# Altium schematic sheet drive.SchDoc
size 400 x 289 mm
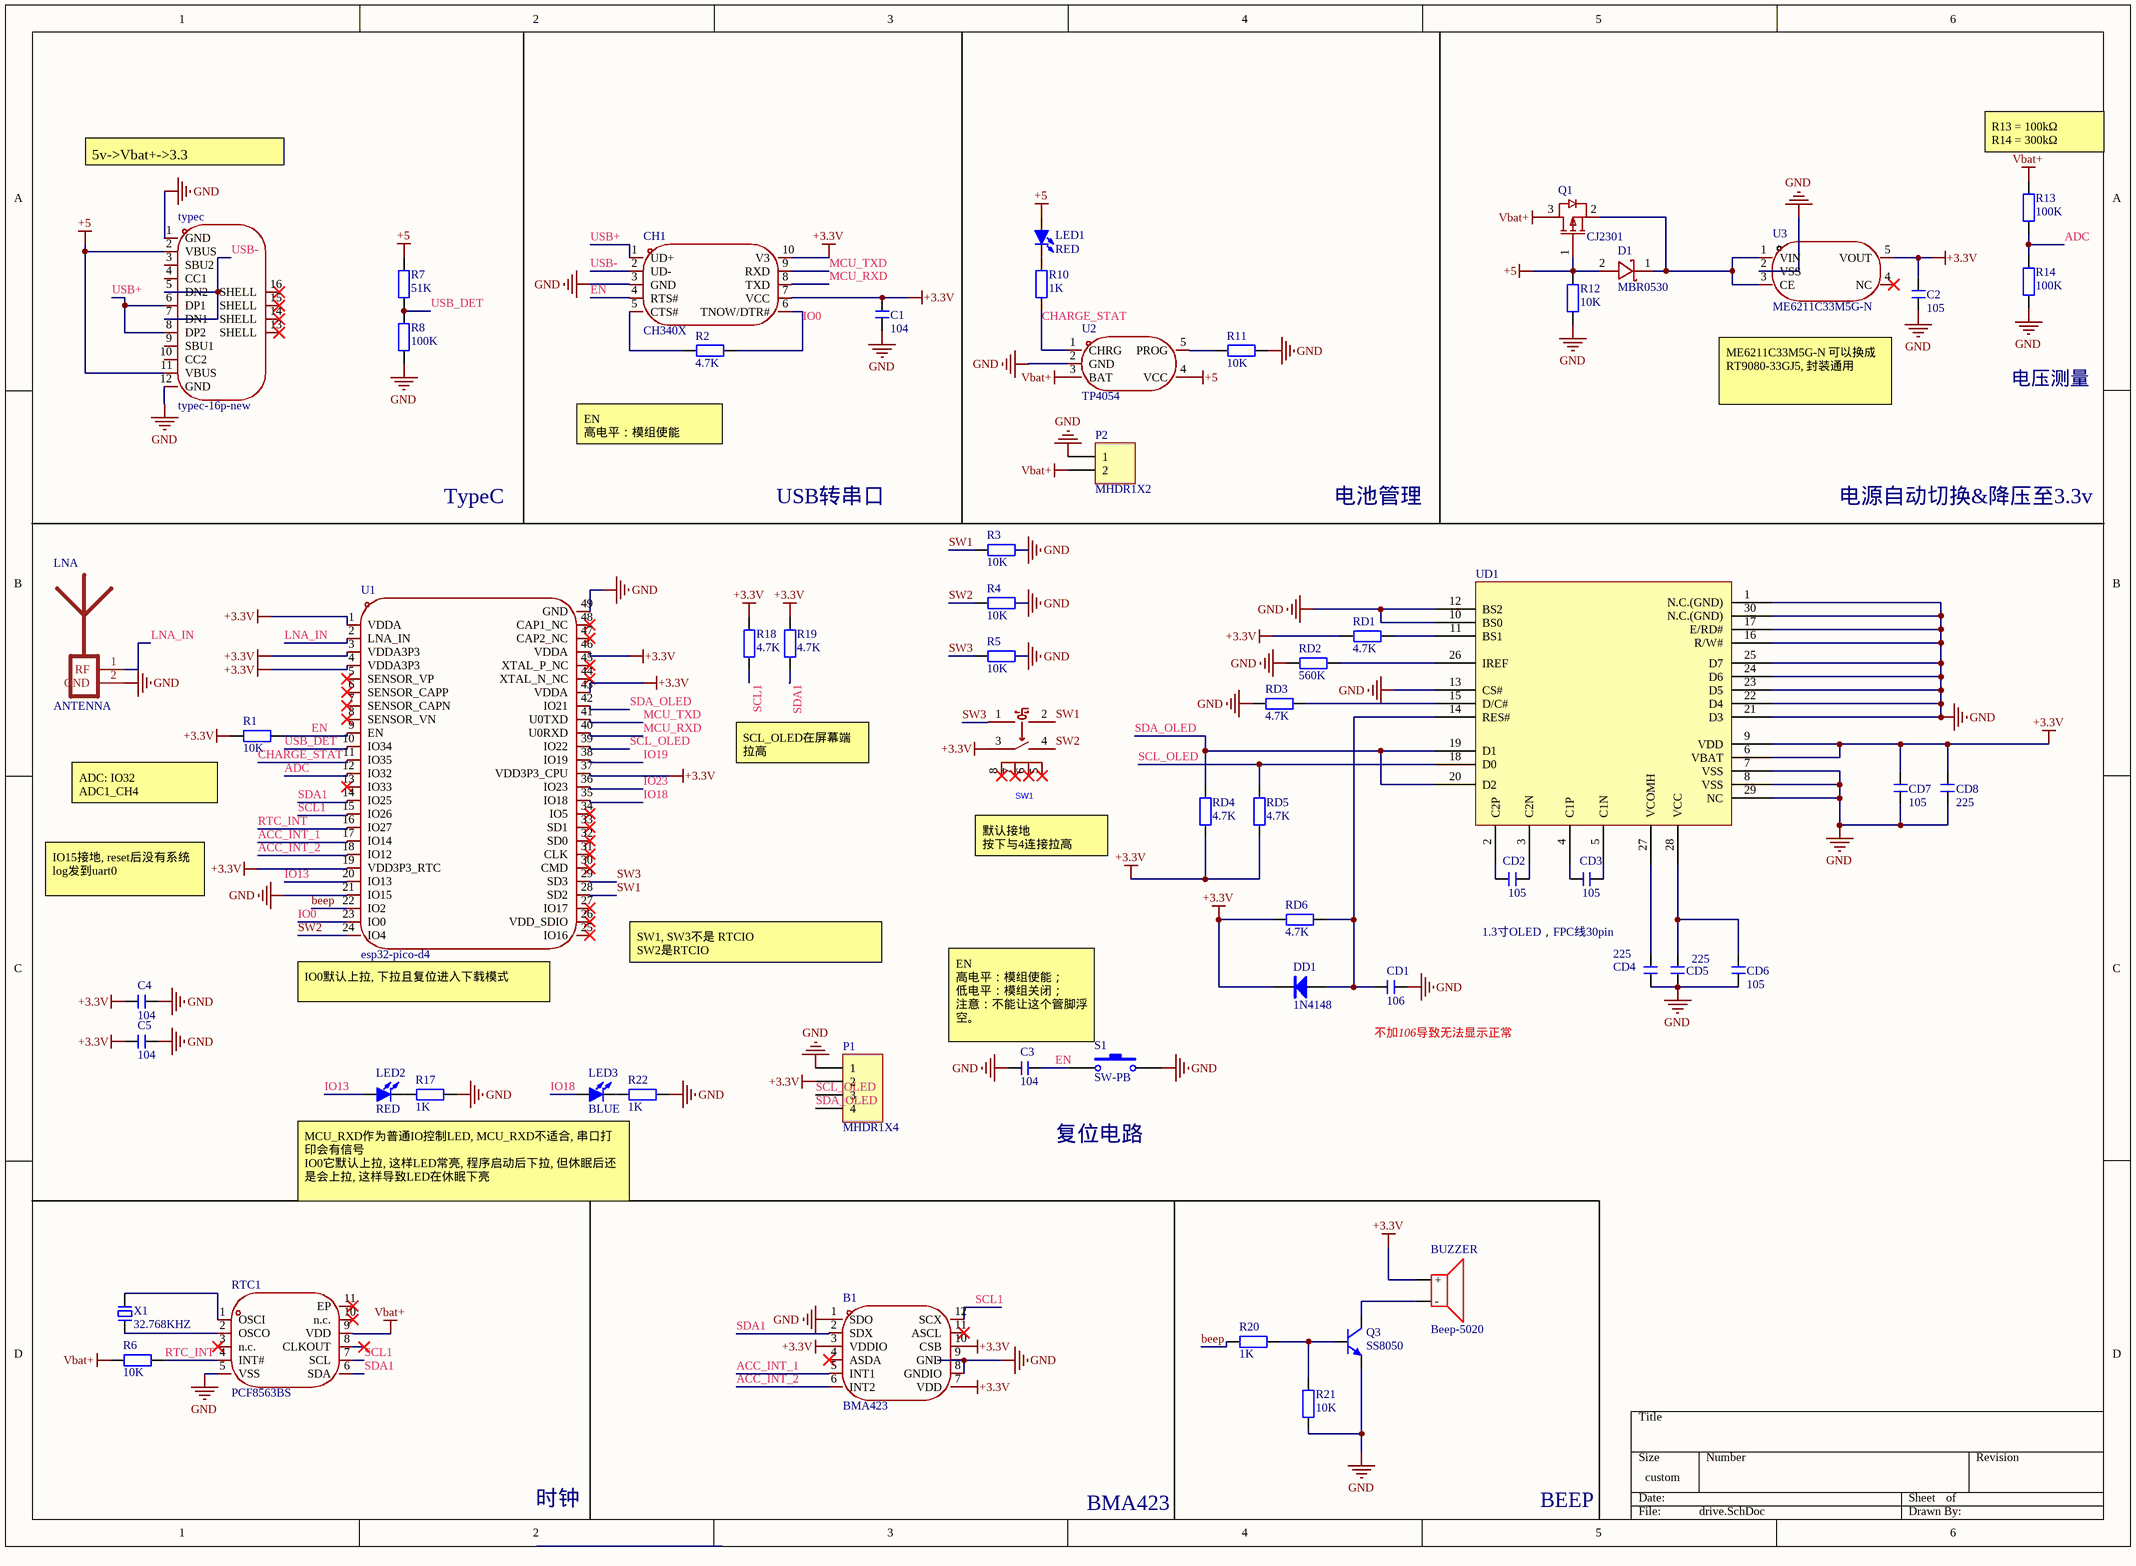
[diagram p0: drive.SchDoc]

## Parts
B1  BMA423  [LGA-12(2x2)-2]
BUZZER  Beep-5020  [5020BUZZER]
C1  104  [C0402-min]
C2  105  [C0402-min]
C3  104  [C0402-min]
C4  104  [C0402-min]
C5  104  [C0402-min]
CD1  106  [C0402-min]
CD2  105  [C0402-min]
CD3  105  [C0402-min]
CD4  225  [C0402-min]
CD5  225  [C0402-min]
CD6  105  [C0402-min]
CD7  105  [C0402-min]
CD8  225  [C0402-min]
CH1  CH340X  [MSOP-10]
D1  MBR0530  [SOD-123]
DD1  1N4148  [SOD-323]
LED1  RED  [LED0402]
LED2  RED  [LED0402]
LED3  BLUE  [LED0402]
LNA  ANTENNA  [SWRA117D]
P1  MHDR1X4  [MHDR1X4]
P2  MHDR1X2  [MHDR1X2]
Q1  CJ2301  [SOT-23-3]
Q3  SS8050  [SOT-23-3]
R1  10K  [R0402]
R2  4.7K  [R0402]
R3  10K  [R0402]
R4  10K  [R0402]
R5  10K  [R0402]
R6  10K  [R0402]
R7  51K  [R0402]
R8  100K  [R0402]
R10  1K  [R0402]
R11  10K  [R0402]
R12  10K  [R0402]
R13  100K  [R0402]
R14  100K  [R0402]
R17  1K  [R0402]
R18  4.7K  [R0402]
R19  4.7K  [R0402]
R20  1K  [R0402]
R21  10K  [R0402]
R22  1K  [R0402]
RD1  4.7K  [R0402]
RD2  560K  [R0402]
RD3  4.7K  [R0402]
RD4  4.7K  [R0402]
RD5  4.7K  [R0402]
RD6  4.7K  [R0402]
RTC1  PCF8563BS  [HVSON-10-EP(3x3)]
S1  SW-PB  [switch-2x3]
SW1  TM-2024A  [LUNBO-min-out]  (value not drawn)
typec  typec-16p-new  [type-c-16p-new]
U1  esp32-pico-d4  [QFN-48-EP(7x7)]
U2  TP4054  [SOT-23-5]
U3  ME6211C33M5G-N  [SOT-23-5]
UD1  1.3寸OLED，FPC线30pin  [0.96OLED]
X1  32.768KHZ  [SMD3215-2P]

## Nets
+3.3V: B1.3(VDDIO) B1.7(VDD) B1.10(CSB) BUZZER.1(+) C1.2 C2.2 C4.2 C5.2 CD7.2 CD8.2 CH1.7(VCC) CH1.10(V3) DD1.2(K) P1.2 R1.1 R18.2 R19.2 RD1.1 RD4.1 RD5.1 RD6.1 SW1.3 U1.1(VDDA) U1.3(VDDA3P3) U1.4(VDDA3P3) U1.19(VDD3P3_RTC) U1.37(VDD3P3_CPU) U1.43(VDDA) U1.46(VDDA) U3.5(VOUT) UD1.6(VBAT) UD1.9(VDD)
+5: D1.2(A) LED1.1(A) Q1.1(G) R7.1 R12.2 typec.2(VBUS) typec.11(VBUS) U2.4(VCC)
GND: B1.1(SDO) B1.8(GNDIO) B1.9(GND) C1.1 C2.1 C3.1 C4.1 C5.1 CD1.2 CD4.1 CD5.1 CD6.1 CD7.1 CD8.1 CH1.3(GND) LNA.2(GND) P1.1 P2.1 Q3.2(E) R3.2 R4.2 R5.2 R8.2 R11.1 R12.1 R14.1 R17.2 R21.1 R22.2 RD2.1 RD3.2 RTC1.5(VSS) S1.2 typec.1(GND) typec.12(GND) U1.21(IO15) U1.49(GND) U2.2(GND) U3.2(VSS) UD1.1(N.C.(GND)) UD1.7(VSS) UD1.8(VSS) UD1.10(BS0) UD1.12(BS2) UD1.13(CS#) UD1.16(R/W#) UD1.17(E/RD#) UD1.21(D3) UD1.22(D4) UD1.23(D5) UD1.24(D6) UD1.25(D7) UD1.29(NC) UD1.30(N.C.(GND))
Vbat+: P2.2 Q1.3(D) R6.1 R13.2 RTC1.9(VDD) U2.3(BAT)
ACC_INT_1: B1.5(INT1) U1.17(IO14)
ACC_INT_2: B1.6(INT2) U1.18(IO12)
ADC: R13.1 R14.2 U1.12(IO32)
beep: R20.1 U1.22(IO2)
CHARGE_STAT: R10.2 U1.11(IO35) U2.1(CHRG)
EN: C3.2 CH1.4(RTS#) R1.2 S1.1 U1.9(EN)
IO0: CH1.6(TNOW/DTR#) R2.1 U1.23(IO0)
IO13: LED2.1(A) U1.20(IO13)
IO18: LED3.1(A) U1.35(IO18)
IO19: U1.38(IO19)
IO23: U1.36(IO23)
LNA_IN: LNA.1(RF) U1.2(LNA_IN)
MCU_RXD: CH1.8(TXD) U1.40(U0RXD)
MCU_TXD: CH1.9(RXD) U1.41(U0TXD)
RTC_INT: R6.2 RTC1.4(INT#) U1.16(IO27)
SCL1: B1.12(SCX) R18.1 RTC1.7(SCL) U1.15(IO26)
SCL_OLED: P1.3 RD5.2 U1.39(IO22) UD1.18(D0)
SDA1: B1.2(SDX) R19.1 RTC1.6(SDA) U1.14(IO25)
SDA_OLED: P1.4 RD4.2 U1.42(IO21) UD1.19(D1) UD1.20(D2)
SW1: R3.1 SW1.2 U1.28(SD2)
SW2: R4.1 SW1.4 U1.24(IO4)
SW3: R5.1 SW1.1 U1.29(SD3)
USB+: CH1.1(UD+) typec.6(DP1) typec.8(DP2)
USB-: CH1.2(UD-) typec.5(DN2) typec.7(DN1)
USB_DET: R7.2 R8.1 U1.10(IO34)
NetBUZZER_2: BUZZER.2(-) Q3.3(C)
NetCD1_1: CD1.1 DD1.1(A) RD6.2 UD1.14(RES#)
NetCD2_1: CD2.1 UD1.2(C2P)
NetCD2_2: CD2.2 UD1.3(C2N)
NetCD3_1: CD3.1 UD1.4(C1P)
NetCD3_2: CD3.2 UD1.5(C1N)
NetCD4_2: CD4.2 UD1.27(VCOMH)
NetCD5_2: CD5.2 CD6.2 UD1.28(VCC)
NetCH1_5: CH1.5(CTS#) R2.2
NetD1_1: D1.1(C) Q1.2(S) U3.1(VIN) U3.3(CE)
NetLED1_2: LED1.2(K) R10.1
NetLED2_2: LED2.2(K) R17.1
NetLED3_2: LED3.2(K) R22.1
NetQ3_1: Q3.1(B) R20.2 R21.2
NetR11_2: R11.2 U2.5(PROG)
NetRD1_2: RD1.2 UD1.11(BS1)
NetRD2_2: RD2.2 UD1.26(IREF)
NetRD3_1: RD3.1 UD1.15(D/C#)
NetRTC1_1: RTC1.1(OSCI) X1.2
NetRTC1_2: RTC1.2(OSCO) X1.1

Not connected (* = marked no-connect by the designer): B1 4(ASDA)* 11(ASCL)*; RTC1 3(n.c.)* 8(CLKOUT)* 10(n.c.)* 11(EP)*; SW1 5* 6* 7* 8*; typec 3(SBU2) 4(CC1) 9(SBU1) 10(CC2) 13(SHELL)* 14(SHELL)* 15(SHELL)* 16(SHELL)*; U1 5(SENSOR_VP)* 6(SENSOR_CAPP)* 7(SENSOR_CAPN)* 8(SENSOR_VN)* 13(IO33)* 25(IO16)* 26(VDD_SDIO)* 27(IO17)* 30(CMD) 31(CLK)* 32(SD0)* 33(SD1)* 34(IO5)* 44(XTAL_N_NC)* 45(XTAL_P_NC)* 47(CAP2_NC)* 48(CAP1_NC)*; U3 4(NC)*

## Notes on the sheet
- (near R13) R13 = 100kΩ
  R14 = 300kΩ
- 5v->Vbat+->3.3
- ME6211C33M5G-N 可以换成RT9080-33GJ5, 封装通用
- 电压测量
- (near R2) EN
  高电平：模组使能
- TypeC
- USB转串口
- 电池管理
- 电源自动切换&降压至3.3v
- SCL_OLED在屏幕端拉高
- (near R1) ADC: IO32
  ADC1_CH4
- IO15接地, reset后没有系统log发到uart0
- (near SW1) 默认接地
  按下与4连接拉高
- (near U1) SW1, SW3不是 RTCIO
  SW2是RTCIO
- (near U1) IO0默认上拉, 下拉且复位进入下载模式
- EN
  高电平：模组使能；
  低电平：模组关闭；
  注意：不能让这个管脚浮空。
- (near CD1) 不加106导致无法显示正常
- 复位电路
- MCU_RXD作为普通IO控制LED, MCU_RXD不适合, 串口打印会有信号
  IO0它默认上拉, 这样LED常亮, 程序启动后下拉, 但休眠后还是会上拉, 这样导致LED在休眠下亮
- 时钟
- BMA423
- BEEP

## Library data of the parts
BUZZER = Beep-5020: 贴片蜂鸣器5020最小封装
C1 = C: 无极性贴片电容; 版权归属: 源创客; BOM名称: 无极性贴片电容; 学习资源: www.ooocke.com
C2-C5 CD1-CD8 = C: 无极性贴片电容; 版权归属: 源创客; 材质: X7R; BOM名称: 无极性贴片电容; 学习资源: www.ooocke.com
D1 = MBR0530T1G
DD1 = 1N4148: 高速开关二极管; 版权归属: 源创客; BOM名称: 高速开关二极管; 学习资源: www.ooocke.com
LED1-LED3 = LED-SMD: 贴片LED; 版权归属: 源创客; BOM名称: 贴片LED; 学习资源: www.ooocke.com
P1 = MHDR1X4: Header, 4-Pin; LatestRevisionDate: 17-Jul-2002; LatestRevisionNote: Re-released for DXP Platform.; Publisher: Altium Limited
P2 = MHDR1X2: Header, 2-Pin; LatestRevisionDate: 17-Jul-2002; LatestRevisionNote: Re-released for DXP Platform.; Publisher: Altium Limited
Q3 = 8050-SMD: 高频放大-NPN型; 版权归属: 源创客; 属性: 40V 1.5A 1W 100MHZ; BOM名称: 高频放大-NPN型; 学习资源: www.ooocke.com
R1-R8 R10-R14 R17-R22 RD1-RD6 = R: 贴片电阻; 版权归属: 源创客; BOM名称: 贴片电阻; 学习资源: www.ooocke.com
S1 = SW-PB: Switch; Published: 24-Mar-1999; LatestRevisionDate: 17-Jul-2002; LatestRevisionNote: Re-released for DXP Platform.; PackageReference: SPST-2; Publisher: Altium Limited; PackageDescription: Switch; 2 Leads
SW1 = lunbo-min: Manufacturer: XKB Connection(中国星坤); Add into BOM: yes; Symbol: TM-2024A; Device: TM-2024A; LCSC Part Name: 四脚两档拨轮开关TM-2024A; Supplier Part: C561480; Manufacturer Part: TM-2024A; Supplier Footprint: SMD; JLCPCB Part Class: Extended Part; Datasheet: https://atta.szlcsc.com/upload/public/pdf/source/20211011/7A4DB3DC37E7D5823B6D92C66ED3191E.pdf; Supplier: LCSC; Convert to PCB: yes
X1 = XTAL-2P: 2脚无源脚晶振; 版权归属: 源创客; 负载电容: CL20pF; BOM名称: 2脚无源脚晶振; 学习资源: www.ooocke.com